# EasyEDA Pro project Board.eprj, board Print A4
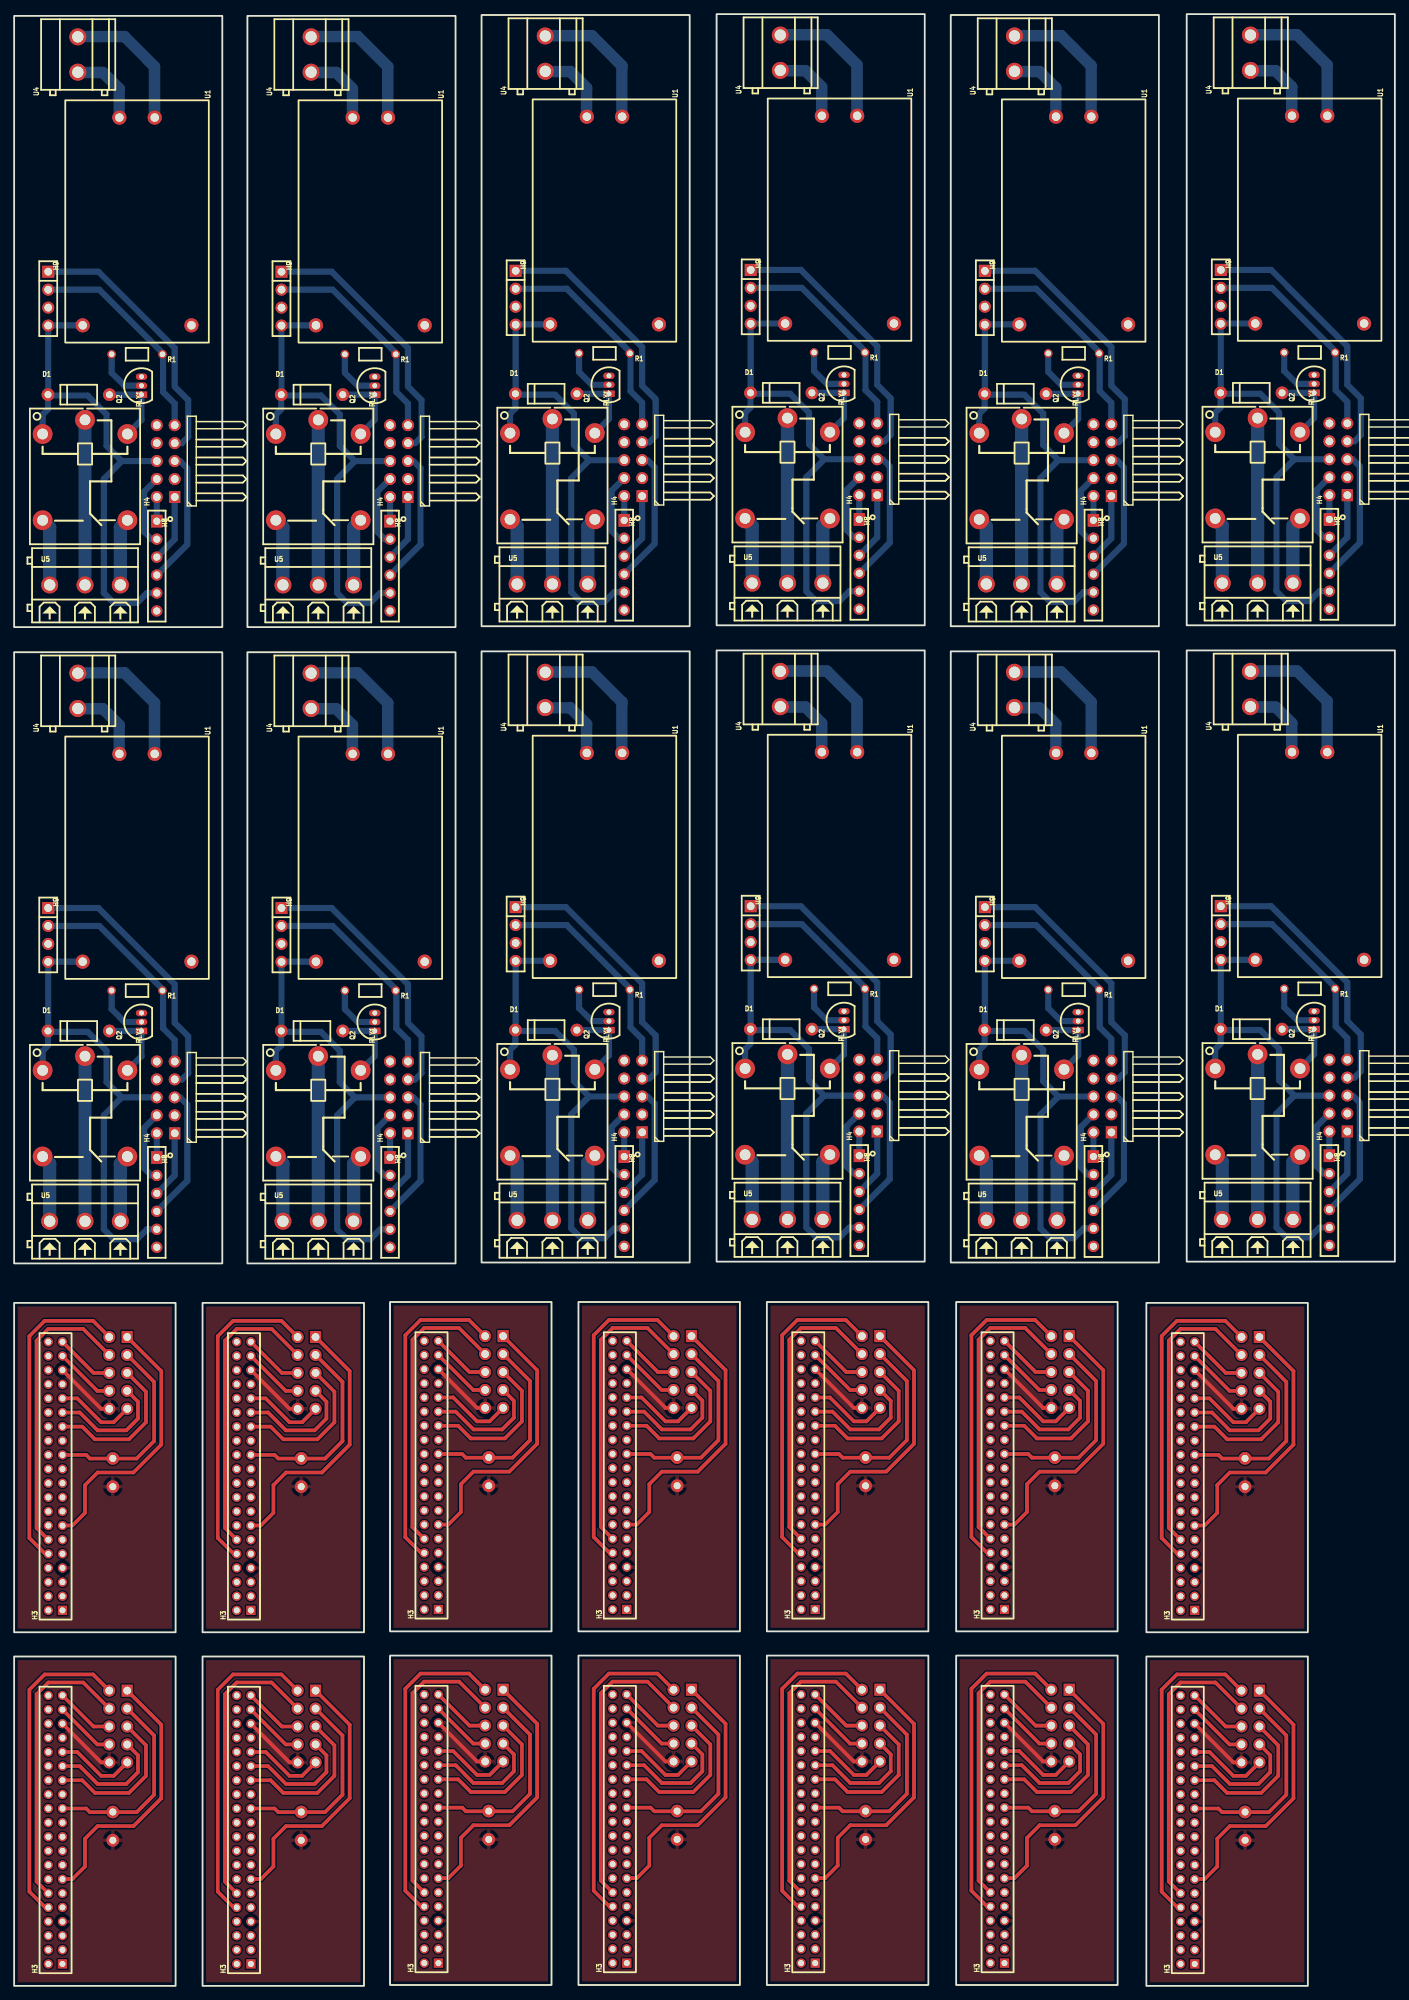
[diagram p4: board, top side]
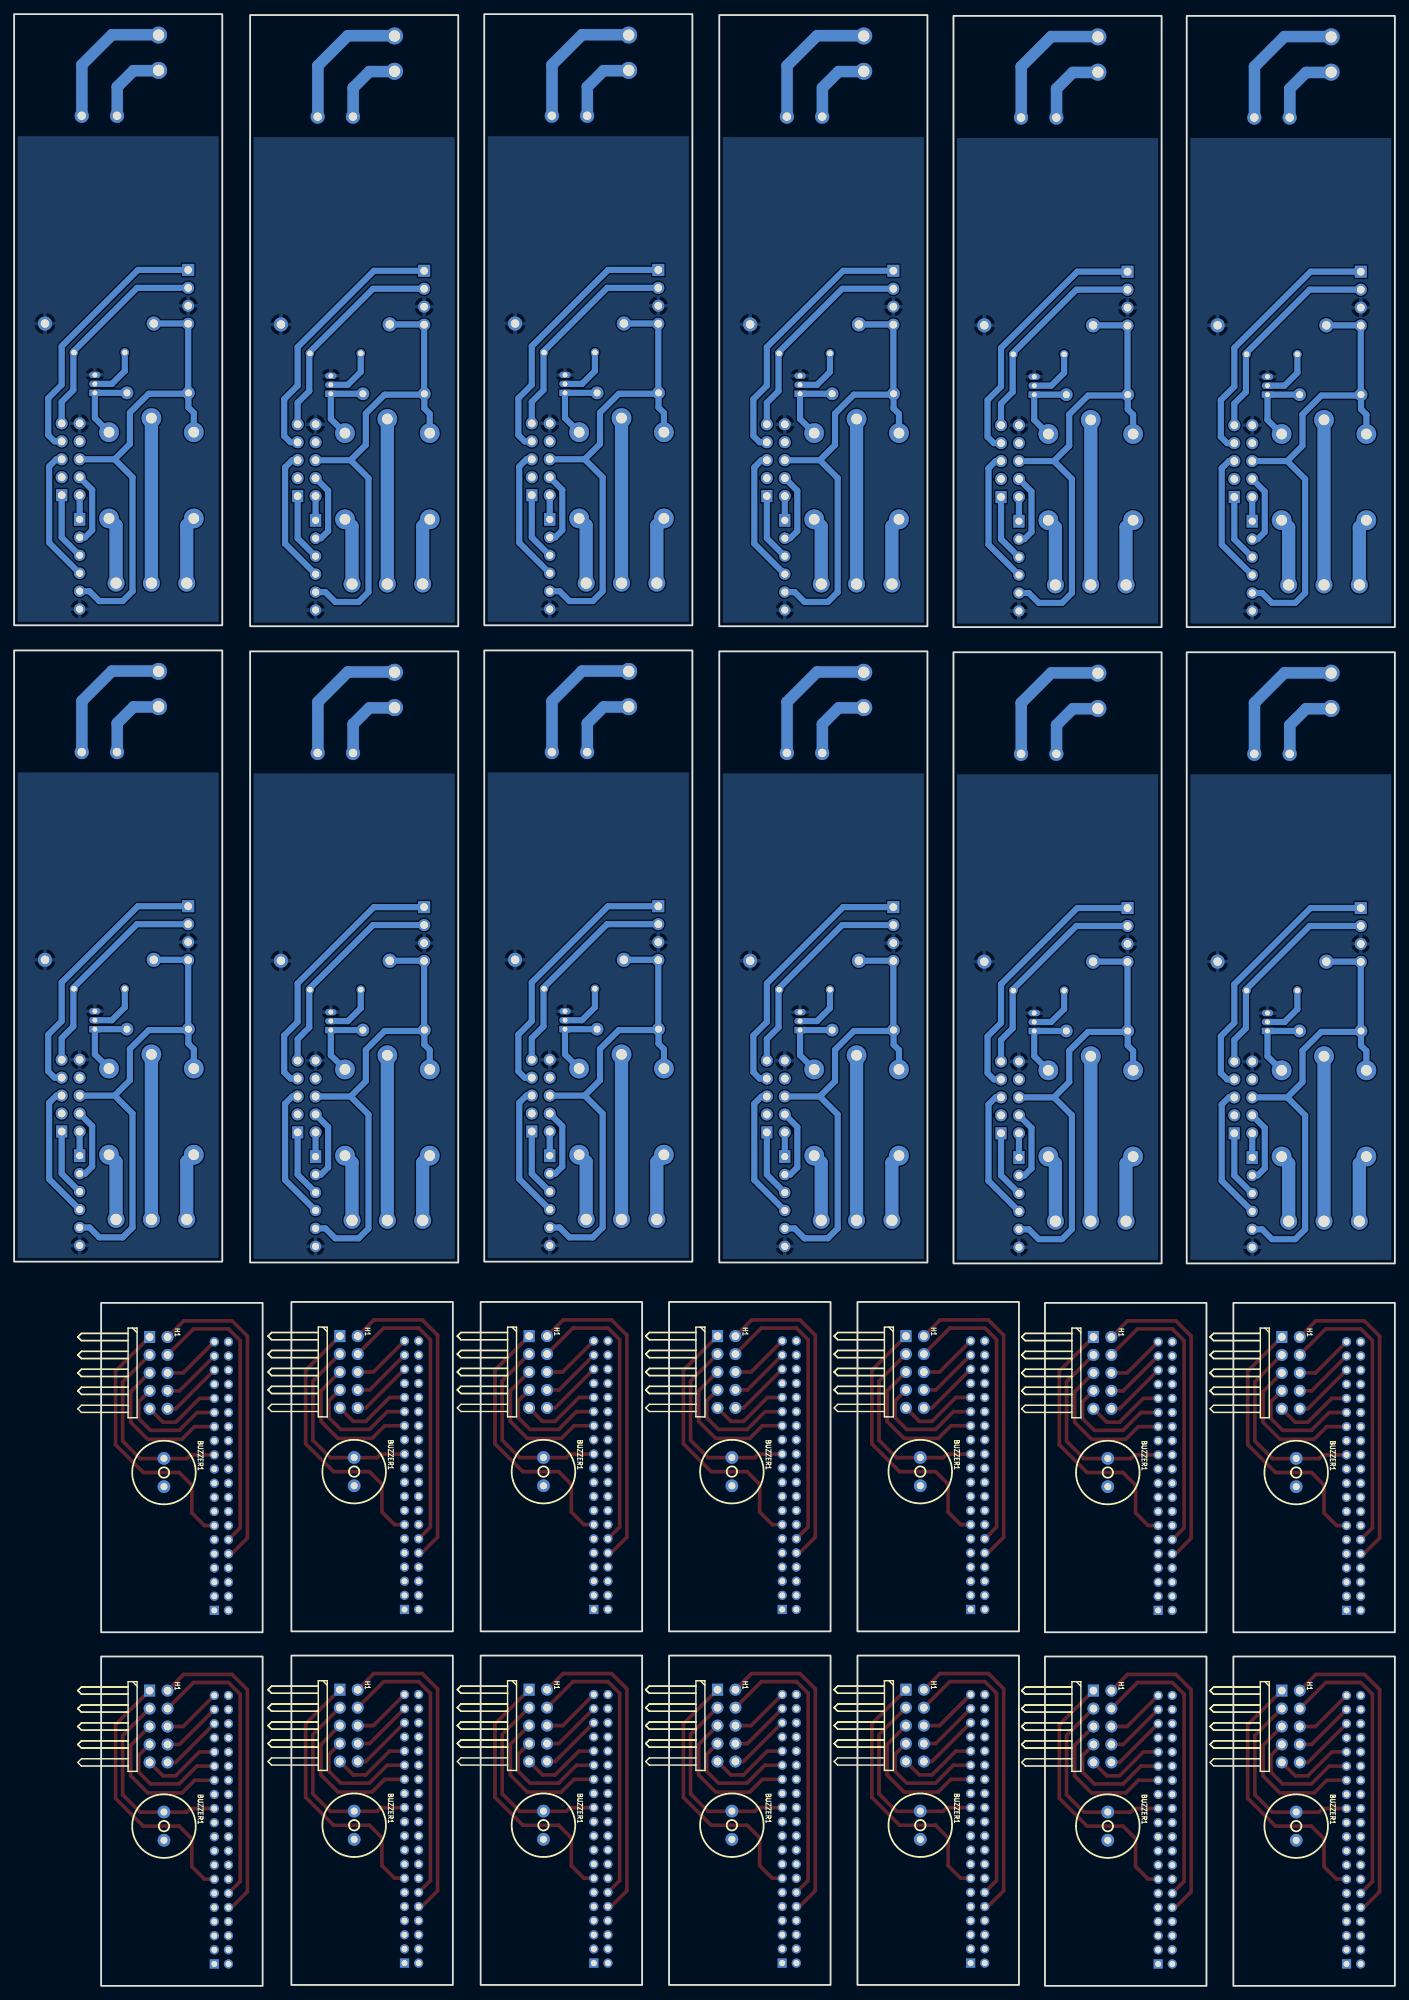
[diagram p5: board, bottom side, seen from below]

Outline 195.45 x 279.02 mm; copper layers: Top Layer, Bottom Layer. Coordinates in mm from the lower left corner of the outline.
Outline path: rectangle 0,50.04 22.86,96.65 ; rectangle 0,0 22.86,46.61 ; rectangle 26.67,50.04 49.53,96.65 ; rectangle 26.67,0 49.53,46.61 ; rectangle 29.46,278.76 0,192.28 ; rectangle 29.46,188.72 0,102.24 ; rectangle 53.21,50.17 76.07,96.77 ; rectangle 53.21,0.13 76.07,46.74 ; rectangle 62.48,278.76 33.02,192.28 ; rectangle 62.48,188.72 33.02,102.24 ; rectangle 79.88,50.17 102.74,96.77 ; rectangle 79.88,0.13 102.74,46.74 ; rectangle 95.63,278.89 66.17,192.41 ; rectangle 95.63,188.85 66.17,102.36 ; rectangle 106.55,50.17 129.41,96.77 ; rectangle 106.55,0.13 129.41,46.74 ; rectangle 128.9,279.02 99.44,192.53 ; rectangle 128.9,188.98 99.44,102.49 ; rectangle 133.35,50.17 156.21,96.77 ; rectangle 133.35,0.13 156.21,46.74 ; rectangle 160.27,50.04 183.13,96.65 ; rectangle 160.27,0 183.13,46.61 ; rectangle 162.05,278.89 132.59,192.41 ; rectangle 162.05,188.85 132.59,102.36 ; rectangle 195.45,279.02 165.99,192.53 ; rectangle 195.45,188.98 165.99,102.49
Stack: Top Layer 0.035mm / Dielectric1 1.51mm FR4 er 4.5 / Bottom Layer 0.035mm

## Design rules (mm)
template: JLCPCB Capability(Two Layers Board)
spacing copperThickness1oz (default): track to track 0.102, other pairs 0.152 to 0.3
spacing copperThickness2oz: track to track 0.203, other pairs 0.152 to 0.3
track width copperThickness1oz (default): min 0.127, default 0.254, max 2.54
track width copperThickness2oz: min 0.203, default 0.254, max 2.54
differential pair differentialPair (default): width min 0.127, default 0.254, max 2.54; gap min 0.152, default 0.152
via viaSize (default): diameter min 0.5, default 0.61, max 10; hole min 0.3, default 0.305, max 6.3

## Placement (name value [footprint] x y rotation side)
BUZZER1  -  [BUZ-TH_BD9.0-P4.00-D0.6-FD]  67.18 72.77 270 bottom
BUZZER1#2  -  [BUZ-TH_BD9.0-P4.00-D0.6-FD]  13.97 22.61 270 bottom
BUZZER1#3  -  [BUZ-TH_BD9.0-P4.00-D0.6-FD]  13.97 72.64 270 bottom
BUZZER1#4  -  [BUZ-TH_BD9.0-P4.00-D0.6-FD]  40.64 72.64 270 bottom
BUZZER1#5  -  [BUZ-TH_BD9.0-P4.00-D0.6-FD]  93.85 72.77 270 bottom
BUZZER1#6  -  [BUZ-TH_BD9.0-P4.00-D0.6-FD]  120.52 72.77 270 bottom
BUZZER1#7  -  [BUZ-TH_BD9.0-P4.00-D0.6-FD]  147.32 72.77 270 bottom
BUZZER1#8  -  [BUZ-TH_BD9.0-P4.00-D0.6-FD]  174.24 72.64 270 bottom
BUZZER1#9  -  [BUZ-TH_BD9.0-P4.00-D0.6-FD]  40.64 22.61 270 bottom
BUZZER1#10  -  [BUZ-TH_BD9.0-P4.00-D0.6-FD]  67.18 22.73 270 bottom
BUZZER1#11  -  [BUZ-TH_BD9.0-P4.00-D0.6-FD]  120.52 22.73 270 bottom
BUZZER1#12  -  [BUZ-TH_BD9.0-P4.00-D0.6-FD]  93.85 22.73 270 bottom
BUZZER1#13  -  [BUZ-TH_BD9.0-P4.00-D0.6-FD]  147.32 22.73 270 bottom
BUZZER1#14  -  [BUZ-TH_BD9.0-P4.00-D0.6-FD]  174.24 22.61 270 bottom
D1  -  [DO-41_BD2.4-L4.7-P8.70-D0.9-RD]  42.16 225.17 0 top
D1#2  -  [DO-41_BD2.4-L4.7-P8.70-D0.9-RD]  75.31 225.3 0 top
D1#3  -  [DO-41_BD2.4-L4.7-P8.70-D0.9-RD]  108.58 225.43 0 top
D1#4  -  [DO-41_BD2.4-L4.7-P8.70-D0.9-RD]  141.73 225.3 0 top
D1#5  -  [DO-41_BD2.4-L4.7-P8.70-D0.9-RD]  175.13 225.43 0 top
D1#6  -  [DO-41_BD2.4-L4.7-P8.70-D0.9-RD]  75.31 135.25 0 top
D1#7  -  [DO-41_BD2.4-L4.7-P8.70-D0.9-RD]  9.14 135.13 0 top
D1#8  -  [DO-41_BD2.4-L4.7-P8.70-D0.9-RD]  42.16 135.13 0 top
D1#9  -  [DO-41_BD2.4-L4.7-P8.70-D0.9-RD]  108.58 135.38 0 top
D1#10  -  [DO-41_BD2.4-L4.7-P8.70-D0.9-RD]  141.73 135.25 0 top
D1#11  -  [DO-41_BD2.4-L4.7-P8.70-D0.9-RD]  175.13 135.38 0 top
D1#12  -  [DO-41_BD2.4-L4.7-P8.70-D0.9-RD]  9.14 225.17 0 top
H1  -  [HDR-TH_10P-P2.54-H-M-R2-C5-S2.54-W12.9]  14.73 86.74 270 bottom
H1#2  -  [HDR-TH_10P-P2.54-H-M-R2-C5-S2.54-W12.9]  41.4 86.74 270 bottom
H1#3  -  [HDR-TH_10P-P2.54-H-M-R2-C5-S2.54-W12.9]  67.95 86.87 270 bottom
H1#4  -  [HDR-TH_10P-P2.54-H-M-R2-C5-S2.54-W12.9]  94.61 86.87 270 bottom
H1#5  -  [HDR-TH_10P-P2.54-H-M-R2-C5-S2.54-W12.9]  121.29 86.87 270 bottom
H1#6  -  [HDR-TH_10P-P2.54-H-M-R2-C5-S2.54-W12.9]  148.08 86.87 270 bottom
H1#7  -  [HDR-TH_10P-P2.54-H-M-R2-C5-S2.54-W12.9]  175.01 86.74 270 bottom
H1#8  -  [HDR-TH_10P-P2.54-H-M-R2-C5-S2.54-W12.9]  14.73 36.7 270 bottom
H1#9  -  [HDR-TH_10P-P2.54-H-M-R2-C5-S2.54-W12.9]  41.4 36.7 270 bottom
H1#10  -  [HDR-TH_10P-P2.54-H-M-R2-C5-S2.54-W12.9]  67.95 36.83 270 bottom
H1#11  -  [HDR-TH_10P-P2.54-H-M-R2-C5-S2.54-W12.9]  94.61 36.83 270 bottom
H1#12  -  [HDR-TH_10P-P2.54-H-M-R2-C5-S2.54-W12.9]  121.29 36.83 270 bottom
H1#13  -  [HDR-TH_10P-P2.54-H-M-R2-C5-S2.54-W12.9]  148.08 36.83 270 bottom
H1#14  -  [HDR-TH_10P-P2.54-H-M-R2-C5-S2.54-W12.9]  175.01 36.7 270 bottom
H3  -  [HDR-TH_40P-P2.00-V-F-R2-C20-S2.00]  5.84 72.14 90 top
H3#2  -  [HDR-TH_40P-P2.00-V-F-R2-C20-S2.00]  32.51 72.14 90 top
H3#3  -  [HDR-TH_40P-P2.00-V-F-R2-C20-S2.00]  59.06 72.26 90 top
H3#4  -  [HDR-TH_40P-P2.00-V-F-R2-C20-S2.00]  85.73 72.26 90 top
H3#5  -  [HDR-TH_40P-P2.00-V-F-R2-C20-S2.00]  112.39 72.26 90 top
H3#6  -  [HDR-TH_40P-P2.00-V-F-R2-C20-S2.00]  139.19 72.26 90 top
H3#7  -  [HDR-TH_40P-P2.00-V-F-R2-C20-S2.00]  166.12 72.14 90 top
H3#8  -  [HDR-TH_40P-P2.00-V-F-R2-C20-S2.00]  5.84 22.1 90 top
H3#9  -  [HDR-TH_40P-P2.00-V-F-R2-C20-S2.00]  32.51 22.1 90 top
H3#10  -  [HDR-TH_40P-P2.00-V-F-R2-C20-S2.00]  59.06 22.23 90 top
H3#11  -  [HDR-TH_40P-P2.00-V-F-R2-C20-S2.00]  85.73 22.23 90 top
H3#12  -  [HDR-TH_40P-P2.00-V-F-R2-C20-S2.00]  112.39 22.23 90 top
H3#13  -  [HDR-TH_40P-P2.00-V-F-R2-C20-S2.00]  139.19 22.23 90 top
H3#14  -  [HDR-TH_40P-P2.00-V-F-R2-C20-S2.00]  166.12 22.1 90 top
H4  -  [HDR-TH_10P-P2.54-H-M-R2-C5-S2.54-W12.9]  54.48 215.77 90 top
H4#2  -  [HDR-TH_10P-P2.54-H-M-R2-C5-S2.54-W12.9]  87.63 215.9 90 top
H4#3  -  [HDR-TH_10P-P2.54-H-M-R2-C5-S2.54-W12.9]  120.9 216.03 90 top
H4#4  -  [HDR-TH_10P-P2.54-H-M-R2-C5-S2.54-W12.9]  154.05 215.9 90 top
H4#5  -  [HDR-TH_10P-P2.54-H-M-R2-C5-S2.54-W12.9]  187.45 216.03 90 top
H4#6  -  [HDR-TH_10P-P2.54-H-M-R2-C5-S2.54-W12.9]  87.63 125.86 90 top
H4#7  -  [HDR-TH_10P-P2.54-H-M-R2-C5-S2.54-W12.9]  21.46 125.73 90 top
H4#8  -  [HDR-TH_10P-P2.54-H-M-R2-C5-S2.54-W12.9]  54.48 125.73 90 top
H4#9  -  [HDR-TH_10P-P2.54-H-M-R2-C5-S2.54-W12.9]  120.9 125.98 90 top
H4#10  -  [HDR-TH_10P-P2.54-H-M-R2-C5-S2.54-W12.9]  154.05 125.86 90 top
H4#11  -  [HDR-TH_10P-P2.54-H-M-R2-C5-S2.54-W12.9]  187.45 125.98 90 top
H4#12  -  [HDR-TH_10P-P2.54-H-M-R2-C5-S2.54-W12.9]  21.46 215.77 90 top
H8  -  [HDR-TH_6P-P2.54-V-F]  53.21 200.91 270 top
H8#2  -  [HDR-TH_6P-P2.54-V-F]  86.36 201.04 270 top
H8#3  -  [HDR-TH_6P-P2.54-V-F]  119.63 201.17 270 top
H8#4  -  [HDR-TH_6P-P2.54-V-F]  152.78 201.04 270 top
H8#5  -  [HDR-TH_6P-P2.54-V-F]  186.18 201.17 270 top
H8#6  -  [HDR-TH_6P-P2.54-V-F]  86.36 111 270 top
H8#7  -  [HDR-TH_6P-P2.54-V-F]  119.63 111.12 270 top
H8#8  -  [HDR-TH_6P-P2.54-V-F]  20.19 110.87 270 top
H8#9  -  [HDR-TH_6P-P2.54-V-F]  53.21 110.87 270 top
H8#10  -  [HDR-TH_6P-P2.54-V-F]  152.78 111 270 top
H8#11  -  [HDR-TH_6P-P2.54-V-F]  186.18 111.12 270 top
H8#12  -  [HDR-TH_6P-P2.54-V-F]  20.19 200.91 270 top
H9  -  [HDR-TH_4P-P2.54-V-F]  37.85 238.76 270 top
H9#2  -  [HDR-TH_4P-P2.54-V-F]  70.99 238.89 270 top
H9#3  -  [HDR-TH_4P-P2.54-V-F]  104.27 239.01 270 top
H9#4  -  [HDR-TH_4P-P2.54-V-F]  137.41 238.89 270 top
H9#5  -  [HDR-TH_4P-P2.54-V-F]  170.81 239.01 270 top
H9#6  -  [HDR-TH_4P-P2.54-V-F]  70.99 148.84 270 top
H9#7  -  [HDR-TH_4P-P2.54-V-F]  37.85 148.72 270 top
H9#8  -  [HDR-TH_4P-P2.54-V-F]  104.27 148.97 270 top
H9#9  -  [HDR-TH_4P-P2.54-V-F]  137.41 148.84 270 top
H9#10  -  [HDR-TH_4P-P2.54-V-F]  170.81 148.97 270 top
H9#11  -  [HDR-TH_4P-P2.54-V-F]  4.83 148.72 270 top
H9#12  -  [HDR-TH_4P-P2.54-V-F]  4.83 238.76 270 top
Q2  -  [TO-92-3_L4.9-W3.7-P1.27-L]  51.05 226.44 90 top
Q2#2  -  [TO-92-3_L4.9-W3.7-P1.27-L]  84.2 226.57 90 top
Q2#3  -  [TO-92-3_L4.9-W3.7-P1.27-L]  117.48 226.7 90 top
Q2#4  -  [TO-92-3_L4.9-W3.7-P1.27-L]  150.62 226.57 90 top
Q2#5  -  [TO-92-3_L4.9-W3.7-P1.27-L]  184.02 226.7 90 top
Q2#6  -  [TO-92-3_L4.9-W3.7-P1.27-L]  84.2 136.53 90 top
Q2#7  -  [TO-92-3_L4.9-W3.7-P1.27-L]  117.48 136.65 90 top
Q2#8  -  [TO-92-3_L4.9-W3.7-P1.27-L]  18.03 136.4 90 top
Q2#9  -  [TO-92-3_L4.9-W3.7-P1.27-L]  51.05 136.4 90 top
Q2#10  -  [TO-92-3_L4.9-W3.7-P1.27-L]  150.62 136.53 90 top
Q2#11  -  [TO-92-3_L4.9-W3.7-P1.27-L]  184.02 136.65 90 top
Q2#12  -  [TO-92-3_L4.9-W3.7-P1.27-L]  18.03 226.44 90 top
R1  -  [RES-TH_BD1.8-L3.2-P7.20-D0.4]  50.42 230.89 180 top
R1#2  -  [RES-TH_BD1.8-L3.2-P7.20-D0.4]  83.57 231.01 180 top
R1#3  -  [RES-TH_BD1.8-L3.2-P7.20-D0.4]  116.84 231.14 180 top
R1#4  -  [RES-TH_BD1.8-L3.2-P7.20-D0.4]  149.99 231.01 180 top
R1#5  -  [RES-TH_BD1.8-L3.2-P7.20-D0.4]  183.39 231.14 180 top
R1#6  -  [RES-TH_BD1.8-L3.2-P7.20-D0.4]  83.57 140.97 180 top
R1#7  -  [RES-TH_BD1.8-L3.2-P7.20-D0.4]  17.4 140.84 180 top
R1#8  -  [RES-TH_BD1.8-L3.2-P7.20-D0.4]  50.42 140.84 180 top
R1#9  -  [RES-TH_BD1.8-L3.2-P7.20-D0.4]  17.4 230.89 180 top
R1#10  -  [RES-TH_BD1.8-L3.2-P7.20-D0.4]  116.84 141.1 180 top
R1#11  -  [RES-TH_BD1.8-L3.2-P7.20-D0.4]  149.99 140.97 180 top
R1#12  -  [RES-TH_BD1.8-L3.2-P7.20-D0.4]  183.39 141.1 180 top
RLY1  -  [RELAY-TH_SRD-XXVDC-XL-C]  43.05 214.5 270 top
RLY1#2  -  [RELAY-TH_SRD-XXVDC-XL-C]  76.2 214.63 270 top
RLY1#3  -  [RELAY-TH_SRD-XXVDC-XL-C]  109.47 214.76 270 top
RLY1#4  -  [RELAY-TH_SRD-XXVDC-XL-C]  142.62 214.63 270 top
RLY1#5  -  [RELAY-TH_SRD-XXVDC-XL-C]  176.02 214.76 270 top
RLY1#6  -  [RELAY-TH_SRD-XXVDC-XL-C]  10.03 124.46 270 top
RLY1#7  -  [RELAY-TH_SRD-XXVDC-XL-C]  43.05 124.46 270 top
RLY1#8  -  [RELAY-TH_SRD-XXVDC-XL-C]  76.2 124.59 270 top
RLY1#9  -  [RELAY-TH_SRD-XXVDC-XL-C]  109.47 124.71 270 top
RLY1#10  -  [RELAY-TH_SRD-XXVDC-XL-C]  142.62 124.59 270 top
RLY1#11  -  [RELAY-TH_SRD-XXVDC-XL-C]  176.02 124.71 270 top
RLY1#12  -  [RELAY-TH_SRD-XXVDC-XL-C]  10.03 214.5 270 top
U1  -  [PWRM-TH_HLK-PM01]  50.42 249.68 270 top
U1#2  -  [PWRM-TH_HLK-PM01]  83.57 249.81 270 top
U1#3  -  [PWRM-TH_HLK-PM01]  116.84 249.94 270 top
U1#4  -  [PWRM-TH_HLK-PM01]  149.99 249.81 270 top
U1#5  -  [PWRM-TH_HLK-PM01]  183.39 249.94 270 top
U1#6  -  [PWRM-TH_HLK-PM01]  83.57 159.77 270 top
U1#7  -  [PWRM-TH_HLK-PM01]  17.4 159.64 270 top
U1#8  -  [PWRM-TH_HLK-PM01]  50.42 159.64 270 top
U1#9  -  [PWRM-TH_HLK-PM01]  116.84 159.89 270 top
U1#10  -  [PWRM-TH_HLK-PM01]  149.99 159.77 270 top
U1#11  -  [PWRM-TH_HLK-PM01]  183.39 159.89 270 top
U1#12  -  [PWRM-TH_HLK-PM01]  17.4 249.68 270 top
U4  -  [CONN-TH_P5.00_KF128-5.0-2P]  42.04 273.3 90 top
U4#2  -  [CONN-TH_P5.00_KF128-5.0-2P]  75.18 273.43 90 top
U4#3  -  [CONN-TH_P5.00_KF128-5.0-2P]  108.46 273.56 90 top
U4#4  -  [CONN-TH_P5.00_KF128-5.0-2P]  141.61 273.43 90 top
U4#5  -  [CONN-TH_P5.00_KF128-5.0-2P]  175.01 273.56 90 top
U4#6  -  [CONN-TH_P5.00_KF128-5.0-2P]  9.02 273.3 90 top
U4#7  -  [CONN-TH_P5.00_KF128-5.0-2P]  75.18 183.39 90 top
U4#8  -  [CONN-TH_P5.00_KF128-5.0-2P]  108.46 183.52 90 top
U4#9  -  [CONN-TH_P5.00_KF128-5.0-2P]  9.02 183.26 90 top
U4#10  -  [CONN-TH_P5.00_KF128-5.0-2P]  42.04 183.26 90 top
U4#11  -  [CONN-TH_P5.00_KF128-5.0-2P]  141.61 183.39 90 top
U4#12  -  [CONN-TH_P5.00_KF128-5.0-2P]  175.01 183.52 90 top
U5  -  [CONN-TH_3P-P5.00_KF128-5.0-3P]  43.05 198.25 0 top
U5#2  -  [CONN-TH_3P-P5.00_KF128-5.0-3P]  76.2 198.37 0 top
U5#3  -  [CONN-TH_3P-P5.00_KF128-5.0-3P]  109.47 198.5 0 top
U5#4  -  [CONN-TH_3P-P5.00_KF128-5.0-3P]  142.62 198.37 0 top
U5#5  -  [CONN-TH_3P-P5.00_KF128-5.0-3P]  176.02 198.5 0 top
U5#6  -  [CONN-TH_3P-P5.00_KF128-5.0-3P]  76.2 108.33 0 top
U5#7  -  [CONN-TH_3P-P5.00_KF128-5.0-3P]  10.03 108.2 0 top
U5#8  -  [CONN-TH_3P-P5.00_KF128-5.0-3P]  109.47 108.46 0 top
U5#9  -  [CONN-TH_3P-P5.00_KF128-5.0-3P]  142.62 108.33 0 top
U5#10  -  [CONN-TH_3P-P5.00_KF128-5.0-3P]  43.05 108.2 0 top
U5#11  -  [CONN-TH_3P-P5.00_KF128-5.0-3P]  176.02 108.46 0 top
U5#12  -  [CONN-TH_3P-P5.00_KF128-5.0-3P]  10.03 198.25 0 top

## Footprints (pads in the part's own frame, mm; a bottom-side part is the same pattern mirrored in y, then rotated)
BUZ-TH_BD9.0-P4.00-D0.6-FD
  round 1.8 hole 1: 1(-2,0) 2(2,0)
CONN-TH_3P-P5.00_KF128-5.0-3P
  round 2.4 hole 1.6: 1(-5,0) 2(0,0) 3(5,0)
CONN-TH_P5.00_KF128-5.0-2P
  round 2.4 hole 1.6: 1(-2.5,0) 2(2.5,0)
DO-41_BD2.4-L4.7-P8.70-D0.9-RD
  round 1.8 hole 1: 1(-4.35,0) 2(4.35,0)
HDR-TH_4P-P2.54-V-F
  rect 1.7x1.7 hole 1.1: 1(-3.81,0)
  round 1.7 hole 1.1: 2(-1.27,0) 3(1.27,0) 4(3.81,0)
HDR-TH_6P-P2.54-V-F
  rect 1.8x1.6 hole 1.02: 1(-6.35,0)
  round 1.6 hole 1.02: 2(-3.81,0) 3(-1.27,0) 4(1.27,0) 5(3.81,0) 6(6.35,0)
HDR-TH_10P-P2.54-H-M-R2-C5-S2.54-W12.9
  rect 1.7x1.575 hole 1.1: 1(-5.08,-1.27)
  round 1.7 hole 1.1: 2(-5.08,1.27) 3(-2.54,-1.27) 4(-2.54,1.27) 5(0,-1.27) 6(0,1.27) 7(2.54,-1.27) 8(2.54,1.27) 9(5.08,-1.27) 10(5.08,1.27)
HDR-TH_40P-P2.00-V-F-R2-C20-S2.00
  rect 1.3x1.3 hole 0.85: 1(-19,-1)
  round 1.3 hole 0.85: 2(-19,1) 3(-17,-1) 4(-17,1) 5(-15,-1) 6(-15,1) 7(-13,-1) 8(-13,1) 9(-11,-1) 10(-11,1) 11(-9,-1) 12(-9,1) 13(-7,-1) 14(-7,1) 15(-5,-1) 16(-5,1) 17(-3,-1) 18(-3,1) 19(-1,-1) 20(-1,1) 21(1,-1) 22(1,1) 23(3,-1) 24(3,1) 25(5,-1) 26(5,1) 27(7,-1) 28(7,1) 29(9,-1) 30(9,1) 31(11,-1) 32(11,1) 33(13,-1) 34(13,1) 35(15,-1) 36(15,1) 37(17,-1) 38(17,1) 39(19,-1) 40(19,1)
PWRM-TH_HLK-PM01
  round 2 hole 1.2: 1(-14.7,2.5) 2(-14.7,-2.5) 3(14.7,7.7) 4(14.7,-7.7)
RELAY-TH_SRD-XXVDC-XL-C
  round 2.794 hole 1.524: 1(-5.1,-6) 2(7.1,-6) 3(7.1,6) 4(-5.1,6) 5(-7.1,0)
RES-TH_BD1.8-L3.2-P7.20-D0.4
  round 1.2 hole 0.8: 1(-3.6,0) 2(3.6,0)
TO-92-3_L4.9-W3.7-P1.27-L
  rect 0.9x1.6 hole 0.7: 1(-1.27,0)
  oval 0.9x1.6 hole 0.7: 2(0,0) 3(1.27,0)

## Nets
3.3V: H1.8 H1#2.8 H1#3.8 H1#4.8 H1#5.8 H1#6.8 H1#7.8 H1#8.8 H1#9.8 H1#10.8 H1#11.8 H1#12.8 H1#13.8 H1#14.8 H3.37 H3#2.37 H3#3.37 H3#4.37 H3#5.37 H3#6.37 H3#7.37 H3#8.37 H3#9.37 H3#10.37 H3#11.37 H3#12.37 H3#13.37 H3#14.37 H4.8 H4#2.8 H4#3.8 H4#4.8 H4#5.8 H4#6.8 H4#7.8 H4#8.8 H4#9.8 H4#10.8 H4#11.8 H4#12.8
5V: D1.1 D1#2.1 D1#3.1 D1#4.1 D1#5.1 D1#6.1 D1#7.1 D1#8.1 D1#9.1 D1#10.1 D1#11.1 D1#12.1 H1.6 H1#2.6 H1#3.6 H1#4.6 H1#5.6 H1#6.6 H1#7.6 H1#8.6 H1#9.6 H1#10.6 H1#11.6 H1#12.6 H1#13.6 H1#14.6 H3.39 H3#2.39 H3#3.39 H3#4.39 H3#5.39 H3#6.39 H3#7.39 H3#8.39 H3#9.39 H3#10.39 H3#11.39 H3#12.39 H3#13.39 H3#14.39 H4.6 H4#2.6 H4#3.6 H4#4.6 H4#5.6 H4#6.6 H4#7.6 H4#8.6 H4#9.6 H4#10.6 H4#11.6 H4#12.6 H8.5 H8#2.5 H8#3.5 H8#4.5 H8#5.5 H8#6.5 H8#7.5 H8#8.5 H8#9.5 H8#10.5 H8#11.5 H8#12.5 H9.4 H9#2.4 H9#3.4 H9#4.4 H9#5.4 H9#6.4 H9#7.4 H9#8.4 H9#9.4 H9#10.4 H9#11.4 H9#12.4 RLY1.1 RLY1#2.1 RLY1#3.1 RLY1#4.1 RLY1#5.1 RLY1#6.1 RLY1#7.1 RLY1#8.1 RLY1#9.1 RLY1#10.1 RLY1#11.1 RLY1#12.1 U1.4 U1#2.4 U1#3.4 U1#4.4 U1#5.4 U1#6.4 U1#7.4 U1#8.4 U1#9.4 U1#10.4 U1#11.4 U1#12.4
GND: BUZZER1.2 BUZZER1#2.2 BUZZER1#3.2 BUZZER1#4.2 BUZZER1#5.2 BUZZER1#6.2 BUZZER1#7.2 BUZZER1#8.2 BUZZER1#9.2 BUZZER1#10.2 BUZZER1#11.2 BUZZER1#12.2 BUZZER1#13.2 BUZZER1#14.2 H1.10 H1#2.10 H1#3.10 H1#4.10 H1#5.10 H1#6.10 H1#7.10 H1#8.10 H1#9.10 H1#10.10 H1#11.10 H1#12.10 H1#13.10 H1#14.10 H3.7 H3.35 H3#2.7 H3#2.35 H3#3.7 H3#3.35 H3#4.7 H3#4.35 H3#5.7 H3#5.35 H3#6.7 H3#6.35 H3#7.7 H3#7.35 H3#8.7 H3#8.35 H3#9.7 H3#9.35 H3#10.7 H3#10.35 H3#11.7 H3#11.35 H3#12.7 H3#12.35 H3#13.7 H3#13.35 H3#14.7 H3#14.35 H4.10 H4#2.10 H4#3.10 H4#4.10 H4#5.10 H4#6.10 H4#7.10 H4#8.10 H4#9.10 H4#10.10 H4#11.10 H4#12.10 H8.6 H8#2.6 H8#3.6 H8#4.6 H8#5.6 H8#6.6 H8#7.6 H8#8.6 H8#9.6 H8#10.6 H8#11.6 H8#12.6 H9.3 H9#2.3 H9#3.3 H9#4.3 H9#5.3 H9#6.3 H9#7.3 H9#8.3 H9#9.3 H9#10.3 H9#11.3 H9#12.3 Q2.3 Q2#2.3 Q2#3.3 Q2#4.3 Q2#5.3 Q2#6.3 Q2#7.3 Q2#8.3 Q2#9.3 Q2#10.3 Q2#11.3 Q2#12.3 U1.3 U1#2.3 U1#3.3 U1#4.3 U1#5.3 U1#6.3 U1#7.3 U1#8.3 U1#9.3 U1#10.3 U1#11.3 U1#12.3
BUZZ: BUZZER1.1 BUZZER1#2.1 BUZZER1#3.1 BUZZER1#4.1 BUZZER1#5.1 BUZZER1#6.1 BUZZER1#7.1 BUZZER1#8.1 BUZZER1#9.1 BUZZER1#10.1 BUZZER1#11.1 BUZZER1#12.1 BUZZER1#13.1 BUZZER1#14.1 H1.3 H1#2.3 H1#3.3 H1#4.3 H1#5.3 H1#6.3 H1#7.3 H1#8.3 H1#9.3 H1#10.3 H1#11.3 H1#12.3 H1#13.3 H1#14.3 H3.23 H3#2.23 H3#3.23 H3#4.23 H3#5.23 H3#6.23 H3#7.23 H3#8.23 H3#9.23 H3#10.23 H3#11.23 H3#12.23 H3#13.23 H3#14.23
CD2: H1.7 H1#2.7 H1#3.7 H1#4.7 H1#5.7 H1#6.7 H1#7.7 H1#8.7 H1#9.7 H1#10.7 H1#11.7 H1#12.7 H1#13.7 H1#14.7 H3.29 H3#2.29 H3#3.29 H3#4.29 H3#5.29 H3#6.29 H3#7.29 H3#8.29 H3#9.29 H3#10.29 H3#11.29 H3#12.29 H3#13.29 H3#14.29
IO32: H4.7 H4#2.7 H4#3.7 H4#4.7 H4#5.7 H4#6.7 H4#7.7 H4#8.7 H4#9.7 H4#10.7 H4#11.7 H4#12.7 H9.1 H9#2.1 H9#3.1 H9#4.1 H9#5.1 H9#6.1 H9#7.1 H9#8.1 H9#9.1 H9#10.1 H9#11.1 H9#12.1
IO33: H1.9 H1#2.9 H1#3.9 H1#4.9 H1#5.9 H1#6.9 H1#7.9 H1#8.9 H1#9.9 H1#10.9 H1#11.9 H1#12.9 H1#13.9 H1#14.9 H3.31 H3#2.31 H3#3.31 H3#4.31 H3#5.31 H3#6.31 H3#7.31 H3#8.31 H3#9.31 H3#10.31 H3#11.31 H3#12.31 H3#13.31 H3#14.31 H4.9 H4#2.9 H4#3.9 H4#4.9 H4#5.9 H4#6.9 H4#7.9 H4#8.9 H4#9.9 H4#10.9 H4#11.9 H4#12.9 H9.2 H9#2.2 H9#3.2 H9#4.2 H9#5.2 H9#6.2 H9#7.2 H9#8.2 H9#9.2 H9#10.2 H9#11.2 H9#12.2 R1.1 R1#2.1 R1#3.1 R1#4.1 R1#5.1 R1#6.1 R1#7.1 R1#8.1 R1#9.1 R1#10.1 R1#11.1 R1#12.1
RX: H1.1 H1#2.1 H1#3.1 H1#4.1 H1#5.1 H1#6.1 H1#7.1 H1#8.1 H1#9.1 H1#10.1 H1#11.1 H1#12.1 H1#13.1 H1#14.1 H3.13 H3#2.13 H3#3.13 H3#4.13 H3#5.13 H3#6.13 H3#7.13 H3#8.13 H3#9.13 H3#10.13 H3#11.13 H3#12.13 H3#13.13 H3#14.13 H4.1 H4#2.1 H4#3.1 H4#4.1 H4#5.1 H4#6.1 H4#7.1 H4#8.1 H4#9.1 H4#10.1 H4#11.1 H4#12.1 H8.3 H8#2.3 H8#3.3 H8#4.3 H8#5.3 H8#6.3 H8#7.3 H8#8.3 H8#9.3 H8#10.3 H8#11.3 H8#12.3
SCL: H1.4 H1#2.4 H1#3.4 H1#4.4 H1#5.4 H1#6.4 H1#7.4 H1#8.4 H1#9.4 H1#10.4 H1#11.4 H1#12.4 H1#13.4 H1#14.4 H3.12 H3#2.12 H3#3.12 H3#4.12 H3#5.12 H3#6.12 H3#7.12 H3#8.12 H3#9.12 H3#10.12 H3#11.12 H3#12.12 H3#13.12 H3#14.12 H4.4 H4#2.4 H4#3.4 H4#4.4 H4#5.4 H4#6.4 H4#7.4 H4#8.4 H4#9.4 H4#10.4 H4#11.4 H4#12.4 H8.2 H8#2.2 H8#3.2 H8#4.2 H8#5.2 H8#6.2 H8#7.2 H8#8.2 H8#9.2 H8#10.2 H8#11.2 H8#12.2
SDA: H1.2 H1#2.2 H1#3.2 H1#4.2 H1#5.2 H1#6.2 H1#7.2 H1#8.2 H1#9.2 H1#10.2 H1#11.2 H1#12.2 H1#13.2 H1#14.2 H3.10 H3#2.10 H3#3.10 H3#4.10 H3#5.10 H3#6.10 H3#7.10 H3#8.10 H3#9.10 H3#10.10 H3#11.10 H3#12.10 H3#13.10 H3#14.10 H4.2 H4#2.2 H4#3.2 H4#4.2 H4#5.2 H4#6.2 H4#7.2 H4#8.2 H4#9.2 H4#10.2 H4#11.2 H4#12.2 H8.1 H8#2.1 H8#3.1 H8#4.1 H8#5.1 H8#6.1 H8#7.1 H8#8.1 H8#9.1 H8#10.1 H8#11.1 H8#12.1
TX: H1.5 H1#2.5 H1#3.5 H1#4.5 H1#5.5 H1#6.5 H1#7.5 H1#8.5 H1#9.5 H1#10.5 H1#11.5 H1#12.5 H1#13.5 H1#14.5 H3.27 H3#2.27 H3#3.27 H3#4.27 H3#5.27 H3#6.27 H3#7.27 H3#8.27 H3#9.27 H3#10.27 H3#11.27 H3#12.27 H3#13.27 H3#14.27 H4.5 H4#2.5 H4#3.5 H4#4.5 H4#5.5 H4#6.5 H4#7.5 H4#8.5 H4#9.5 H4#10.5 H4#11.5 H4#12.5 H8.4 H8#2.4 H8#3.4 H8#4.4 H8#5.4 H8#6.4 H8#7.4 H8#8.4 H8#9.4 H8#10.4 H8#11.4 H8#12.4
$1N407: RLY1.3 RLY1#2.3 RLY1#3.3 RLY1#4.3 RLY1#5.3 RLY1#6.3 RLY1#7.3 RLY1#8.3 RLY1#9.3 RLY1#10.3 RLY1#11.3 RLY1#12.3 U5.3 U5#2.3 U5#3.3 U5#4.3 U5#5.3 U5#6.3 U5#7.3 U5#8.3 U5#9.3 U5#10.3 U5#11.3 U5#12.3
$1N669: Q2.2 Q2#2.2 Q2#3.2 Q2#4.2 Q2#5.2 Q2#6.2 Q2#7.2 Q2#8.2 Q2#9.2 Q2#10.2 Q2#11.2 Q2#12.2 R1.2 R1#2.2 R1#3.2 R1#4.2 R1#5.2 R1#6.2 R1#7.2 R1#8.2 R1#9.2 R1#10.2 R1#11.2 R1#12.2
$1N719: U1.1 U1#2.1 U1#3.1 U1#4.1 U1#5.1 U1#6.1 U1#7.1 U1#8.1 U1#9.1 U1#10.1 U1#11.1 U1#12.1 U4.2 U4#2.2 U4#3.2 U4#4.2 U4#5.2 U4#6.2 U4#7.2 U4#8.2 U4#9.2 U4#10.2 U4#11.2 U4#12.2
$1N726: U1.2 U1#2.2 U1#3.2 U1#4.2 U1#5.2 U1#6.2 U1#7.2 U1#8.2 U1#9.2 U1#10.2 U1#11.2 U1#12.2 U4.1 U4#2.1 U4#3.1 U4#4.1 U4#5.1 U4#6.1 U4#7.1 U4#8.1 U4#9.1 U4#10.1 U4#11.1 U4#12.1
$1N778: RLY1.5 RLY1#2.5 RLY1#3.5 RLY1#4.5 RLY1#5.5 RLY1#6.5 RLY1#7.5 RLY1#8.5 RLY1#9.5 RLY1#10.5 RLY1#11.5 RLY1#12.5 U5.2 U5#2.2 U5#3.2 U5#4.2 U5#5.2 U5#6.2 U5#7.2 U5#8.2 U5#9.2 U5#10.2 U5#11.2 U5#12.2
$1N787: RLY1.2 RLY1#2.2 RLY1#3.2 RLY1#4.2 RLY1#5.2 RLY1#6.2 RLY1#7.2 RLY1#8.2 RLY1#9.2 RLY1#10.2 RLY1#11.2 RLY1#12.2 U5.1 U5#2.1 U5#3.1 U5#4.1 U5#5.1 U5#6.1 U5#7.1 U5#8.1 U5#9.1 U5#10.1 U5#11.1 U5#12.1
$1N2276: D1.2 D1#2.2 D1#3.2 D1#4.2 D1#5.2 D1#6.2 D1#7.2 D1#8.2 D1#9.2 D1#10.2 D1#11.2 D1#12.2 Q2.1 Q2#2.1 Q2#3.1 Q2#4.1 Q2#5.1 Q2#6.1 Q2#7.1 Q2#8.1 Q2#9.1 Q2#10.1 Q2#11.1 Q2#12.1 RLY1.4 RLY1#2.4 RLY1#3.4 RLY1#4.4 RLY1#5.4 RLY1#6.4 RLY1#7.4 RLY1#8.4 RLY1#9.4 RLY1#10.4 RLY1#11.4 RLY1#12.4

Pads without a net: H3 1 2 3 4 5 6 8 9 11 14 15 16 17 18 19 20 21 22 24 25 26 28 30 32 33 34 36 38 40; H3#2 1 2 3 4 5 6 8 9 11 14 15 16 17 18 19 20 21 22 24 25 26 28 30 32 33 34 36 38 40; H3#3 1 2 3 4 5 6 8 9 11 14 15 16 17 18 19 20 21 22 24 25 26 28 30 32 33 34 36 38 40; H3#4 1 2 3 4 5 6 8 9 11 14 15 16 17 18 19 20 21 22 24 25 26 28 30 32 33 34 36 38 40; H3#5 1 2 3 4 5 6 8 9 11 14 15 16 17 18 19 20 21 22 24 25 26 28 30 32 33 34 36 38 40; H3#6 1 2 3 4 5 6 8 9 11 14 15 16 17 18 19 20 21 22 24 25 26 28 30 32 33 34 36 38 40; H3#7 1 2 3 4 5 6 8 9 11 14 15 16 17 18 19 20 21 22 24 25 26 28 30 32 33 34 36 38 40; H3#8 1 2 3 4 5 6 8 9 11 14 15 16 17 18 19 20 21 22 24 25 26 28 30 32 33 34 36 38 40; H3#9 1 2 3 4 5 6 8 9 11 14 15 16 17 18 19 20 21 22 24 25 26 28 30 32 33 34 36 38 40; H3#10 1 2 3 4 5 6 8 9 11 14 15 16 17 18 19 20 21 22 24 25 26 28 30 32 33 34 36 38 40; H3#11 1 2 3 4 5 6 8 9 11 14 15 16 17 18 19 20 21 22 24 25 26 28 30 32 33 34 36 38 40; H3#12 1 2 3 4 5 6 8 9 11 14 15 16 17 18 19 20 21 22 24 25 26 28 30 32 33 34 36 38 40; H3#13 1 2 3 4 5 6 8 9 11 14 15 16 17 18 19 20 21 22 24 25 26 28 30 32 33 34 36 38 40; H3#14 1 2 3 4 5 6 8 9 11 14 15 16 17 18 19 20 21 22 24 25 26 28 30 32 33 34 36 38 40; H4 3; H4#2 3; H4#3 3; H4#4 3; H4#5 3; H4#6 3; H4#7 3; H4#8 3; H4#9 3; H4#10 3; H4#11 3; H4#12 3

## Routing (per net, layer and track width the routed paths; a pad name or vN(x,y) marks a point on that pad's centre or on a via; arc(x,y) is an arc through that point)
3.3V: length 121.3
  Top Layer w0.52: H1#14.8 172.05,34.16 H3#14.37 ; H1#12.8 118.33,34.29 H3#12.37 ; H1.8 11.78,84.2 H3.37 ; H1#8.8 11.78,34.16 H3#8.37 ; H3#11.37 91.66,34.29 H1#11.8 ; H3#2.37 38.45,84.2 H1#2.8 ; H1#9.8 38.45,34.16 H3#9.37 ; H1#10.8 64.99,34.29 H3#10.37 ; H1#4.8 91.66,84.33 H3#4.37 ; H3#6.37 145.13,84.33 H1#6.8 ; H1#7.8 172.05,84.2 H3#7.37 ; H1#3.8 64.99,84.33 H3#3.37 ; H1#5.8 118.33,84.33 H3#5.37 ; H1#13.8 145.13,34.29 H3#13.37
5V: length 965.1
  Top Layer w0.52: H3#10.39 64.45,36.83 H1#10.6 ; H3#9.39 37.91,36.7 H1#9.6 ; H3#14.39 171.51,36.7 H1#14.6 ; H3#11.39 91.12,36.83 H1#11.6 ; H3#5.39 117.79,86.87 H1#5.6 ; H1#8.6 11.24,36.7 H3#8.39 ; H1#12.6 117.79,36.83 H3#12.39 ; H1#3.6 64.45,86.87 H3#3.39 ; H3.39 11.24,86.74 H1.6 ; H3#13.39 144.59,36.83 H1#13.6 ; H1#4.6 91.12,86.87 H3#4.39 ; H1#7.6 171.51,86.74 H3#7.39 ; H1#6.6 144.59,86.87 H3#6.39 ; H3#2.39 37.91,86.74 H1#2.6
  Bottom Layer w0.87: D1#9.1 104.23,133.32 103.47,132.56 RLY1#9.1 ; D1#9.1 104.27,135.41 H9#8.4 ; D1#9.1 104.36,135.25 109.86,135.25 112.52,132.59 112.52,128.14 114.68,125.98 ; H9#12.4 4.83,225.2 D1#12.1 ; 147.83,215.9 145.67,218.06 145.67,222.5 143,225.17 137.51,225.17 137.38,225.3 ; 147.83,215.9 H4#4.6 ; 147.83,215.9 145.29,213.36 145.29,197.23 146.69,195.83 149.99,195.83 151.38,197.23 H8#4.5 ; H4#5.6 181.23,216.03 ; 181.23,216.03 179.07,218.19 179.07,222.63 176.4,225.3 170.91,225.3 D1#5.1 ; 181.23,216.03 178.69,213.49 178.69,197.36 180.09,195.96 183.39,195.96 184.79,197.36 H8#5.5 ; D1#11.1 170.81,135.41 H9#10.4 ; D1#11.1 170.91,135.25 176.4,135.25 179.07,132.59 179.07,128.14 181.23,125.98 ; D1#11.1 170.78,133.32 170.02,132.56 RLY1#11.1 ; H8#11.5 184.79,107.31 183.39,105.92 180.09,105.92 178.69,107.31 178.69,123.44 181.23,125.98 ; H4#9.6 114.68,125.98 ; 114.68,125.98 112.14,123.44 112.14,107.31 113.54,105.92 116.84,105.92 118.24,107.31 H8#7.5 ; 37.05,219.6 37.05,222.35 37.81,223.11 D1.1 ; 137.38,225.3 137.38,223.23 136.62,222.47 RLY1#4.1 ; 137.38,225.3 137.41,225.33 H9#4.4 ; 181.23,125.98 H4#11.6 ; D1#2.1 70.96,223.23 70.2,222.47 RLY1#2.1 ; D1#2.1 70.99,225.33 H9#2.4 ; D1#2.1 71.09,225.17 76.58,225.17 79.25,222.5 79.25,218.06 81.41,215.9 ; 5.08,234.95 5.11,234.98 U1#12.4 ; 104.52,145.16 104.55,145.19 U1#9.4 ; D1#5.1 170.81,225.46 H9#5.4 ; D1#5.1 170.78,223.36 170.02,222.6 170.02,219.86 ; D1#7.1 4.83,135.16 H9#11.4 ; D1#7.1 4.79,133.06 4.03,132.3 RLY1#6.1 ; D1#7.1 4.92,135 10.41,135 13.08,132.33 13.08,127.89 15.24,125.73 ; H9#6.4 70.99,135.29 D1#6.1 ; 137.38,135.25 137.41,135.29 H9#9.4 ; 137.38,135.25 137.38,133.19 136.62,132.43 RLY1#10.1 ; 137.38,135.25 137.51,135.13 143,135.13 145.67,132.46 145.67,128.02 147.83,125.86 ; D1#6.1 70.96,133.19 70.2,132.43 RLY1#8.1 ; D1#6.1 71.09,135.13 76.58,135.13 79.25,132.46 79.25,128.02 81.41,125.86 ; H4#2.6 81.41,215.9 ; 81.41,215.9 78.87,213.36 78.87,197.23 80.26,195.83 83.57,195.83 84.96,197.23 H8#2.5 ; D1#3.1 104.27,225.46 H9#3.4 ; D1#3.1 104.23,223.36 103.47,222.6 103.47,219.86 ; D1#3.1 104.36,225.3 109.86,225.3 112.52,222.63 112.52,218.19 114.68,216.03 ; 38.1,234.95 38.13,234.98 U1.4 ; 104.52,235.2 104.55,235.24 U1#3.4 ; D1#8.1 37.85,135.16 H9#7.4 ; D1#8.1 37.81,133.06 37.05,132.3 RLY1#7.1 ; D1#8.1 37.94,135 43.43,135 46.1,132.33 46.1,127.89 48.26,125.73 ; 171.07,145.16 171.1,145.19 U1#11.4 ; 38.1,144.91 38.13,144.94 U1#8.4 ; H4#12.6 15.24,215.77 ; 15.24,215.77 13.08,217.93 13.08,222.38 10.41,225.04 4.92,225.04 D1#12.1 ; 15.24,215.77 12.7,213.23 12.7,197.1 14.1,195.71 17.4,195.71 18.8,197.1 H8#12.5 ; H8.5 51.82,197.1 50.42,195.71 47.12,195.71 45.72,197.1 45.72,213.23 48.26,215.77 ; U1#7.4 5.11,144.94 5.08,144.91 ; D1#12.1 4.79,223.11 4.03,222.35 4.03,219.6 ; 48.26,215.77 46.1,217.93 46.1,222.38 43.43,225.04 37.94,225.04 D1.1 ; 48.26,215.77 H4.6 ; H8#3.5 118.24,197.36 116.84,195.96 113.54,195.96 112.14,197.36 112.14,213.49 114.68,216.03 ; U1#5.4 171.1,235.24 171.07,235.2 ; D1.1 37.85,225.2 H9.4 ; U1#6.4 71.28,145.07 71.25,145.03 ; U1#2.4 71.28,235.11 71.25,235.08 ; 147.83,125.86 145.29,123.32 145.29,107.19 146.69,105.79 149.99,105.79 151.38,107.19 H8#10.5 ; 147.83,125.86 H4#10.6 ; 137.67,145.03 137.7,145.07 U1#10.4 ; 114.68,216.03 H4#3.6 ; 15.24,125.73 12.7,123.19 12.7,107.06 14.1,105.66 17.4,105.66 18.8,107.06 H8#8.5 ; 15.24,125.73 H4#7.6 ; H4#8.6 48.26,125.73 ; 48.26,125.73 45.72,123.19 45.72,107.06 47.12,105.66 50.42,105.66 51.82,107.06 H8#9.5 ; 81.41,125.86 78.87,123.32 78.87,107.19 80.26,105.79 83.57,105.79 84.96,107.19 H8#6.5 ; 81.41,125.86 H4#6.6 ; 137.67,235.08 137.7,235.11 U1#4.4
GND: length 124.4
  Top Layer w0.52: H3#9.35 38.99,31.62 40.13,31.62 ; H1#10.10 65.53,31.75 H3#10.35 ; H1#2.10 38.99,81.66 H3#2.35 ; H1#7.10 172.59,81.66 H3#7.35 ; H1#4.10 92.2,81.79 H3#4.35 ; H3#11.35 92.2,31.75 H1#11.10 ; H1.10 12.32,81.66 H3.35 ; H1#13.10 145.67,31.75 H3#13.35 ; H1#12.10 118.87,31.75 H3#12.35 ; H3#14.35 172.59,31.62 173.74,31.62 ; H1#3.10 65.53,81.79 H3#3.35 ; H3#6.35 145.67,81.79 H1#6.10 ; 13.46,31.62 12.32,31.62 H3#8.35 ; H1#5.10 118.87,81.79 H3#5.35
BUZZ: length 391.7
  Top Layer w0.52: 176.28,39.24 180.09,35.43 180.09,27.05 177.61,24.58 171,24.58 170.48,25.1 H3#14.23 ; H3#2.23 36.88,75.14 37.4,74.62 44.01,74.62 46.48,77.09 46.48,85.47 H1#2.3 ; H1#10.3 73.03,35.56 73.03,27.18 70.55,24.71 63.94,24.71 63.42,25.23 H3#10.23 ; H3#13.23 143.56,25.23 144.08,24.71 150.69,24.71 153.16,27.18 153.16,35.56 H1#13.3 ; H1#12.3 126.36,35.56 126.36,27.18 123.89,24.71 117.28,24.71 116.76,25.23 H3#12.23 ; H3#11.23 90.09,25.23 90.61,24.71 97.22,24.71 99.7,27.18 99.7,35.56 H1#11.3 ; H3#7.23 170.48,75.14 171,74.62 177.61,74.62 180.09,77.09 180.09,85.47 H1#7.3 ; H3.23 10.21,75.14 10.73,74.62 17.34,74.62 19.81,77.09 19.81,85.47 H1.3 ; H1#5.3 126.36,85.6 126.36,77.22 123.89,74.74 117.28,74.74 116.76,75.26 H3#5.23 ; H3#8.23 10.21,25.1 10.73,24.58 17.34,24.58 19.81,27.05 19.81,35.43 16,39.24 ; 42.67,39.24 46.48,35.43 46.48,27.05 44.01,24.58 37.4,24.58 36.88,25.1 H3#9.23 ; H3#4.23 90.09,75.26 90.61,74.74 97.22,74.74 99.7,77.22 99.7,85.6 H1#4.3 ; H1#3.3 73.03,85.6 73.03,77.22 70.55,74.74 63.94,74.74 63.42,75.26 H3#3.23 ; H1#6.3 153.16,85.6 153.16,77.22 150.69,74.74 144.08,74.74 143.56,75.26 H3#6.23
CD2: length 237.9
  Top Layer w0.52: H1#10.7 70.75,32.75 70.75,30.37 69.09,28.7 65.02,28.7 62.5,31.23 H3#10.29 ; H1#6.7 150.89,82.79 150.89,80.41 149.23,78.74 145.16,78.74 142.64,81.26 H3#6.29 ; H3#5.29 115.84,81.26 118.36,78.74 122.43,78.74 124.09,80.41 124.09,82.79 H1#5.7 ; H1.7 17.54,82.66 17.54,80.28 15.88,78.61 11.81,78.61 9.29,81.14 H3.29 ; H3#7.29 169.56,81.14 172.08,78.61 176.15,78.61 177.81,80.28 177.81,82.66 H1#7.7 ; H1#14.7 177.81,32.62 177.81,30.24 176.15,28.58 172.08,28.58 169.56,31.1 H3#14.29 ; H1#11.7 97.42,32.75 97.42,30.37 95.76,28.7 91.69,28.7 89.17,31.23 H3#11.29 ; H1#12.7 124.09,32.75 124.09,30.37 122.43,28.7 118.36,28.7 115.84,31.23 H3#12.29 ; H3#9.29 35.96,31.1 38.48,28.58 42.55,28.58 44.21,30.24 44.21,32.62 H1#9.7 ; H1#13.7 150.89,32.75 150.89,30.37 149.23,28.7 145.16,28.7 142.64,31.23 H3#13.29 ; H1#4.7 97.42,82.79 97.42,80.41 95.76,78.74 91.69,78.74 89.17,81.26 H3#4.29 ; H1#2.7 44.21,82.66 44.21,80.28 42.55,78.61 38.48,78.61 35.96,81.14 H3#2.29 ; H1#8.7 17.54,32.62 17.54,30.24 15.88,28.58 11.81,28.58 9.29,31.1 H3#8.29 ; H3#3.29 62.5,81.26 65.02,78.74 69.09,78.74 70.75,80.41 70.75,82.79 H1#3.7
IO32: length 456.2
  Bottom Layer w0.87: 170.81,152.78 177.93,152.78 188.72,141.99 188.72,136.53 190.63,134.62 190.63,129.41 189.74,128.52 188.72,128.52 ; H4#4.7 156.34,218.44 157.23,219.33 157.23,224.54 155.32,226.44 155.32,231.9 144.53,242.7 137.41,242.7 ; 70.99,242.7 78.11,242.7 88.9,231.9 88.9,226.44 90.8,224.54 90.8,219.33 89.92,218.44 H4#2.7 ; 122.17,218.57 123.19,218.57 124.08,219.46 124.08,224.66 122.17,226.57 122.17,232.03 111.38,242.82 H9#3.1 ; H4#8.7 56.77,128.27 57.66,129.16 57.66,134.37 55.75,136.27 55.75,141.73 44.96,152.53 H9#7.1 ; 88.9,128.4 89.92,128.4 90.8,129.29 90.8,134.49 88.9,136.4 88.9,141.86 78.11,152.65 H9#6.1 ; H9.1 44.96,242.57 55.75,231.78 55.75,226.31 57.66,224.41 57.66,219.2 56.77,218.31 H4.7 ; H9#11.1 11.94,152.53 22.73,141.73 22.73,136.27 24.64,134.37 24.64,129.16 23.75,128.27 H4#7.7 ; H9#12.1 11.94,242.57 22.73,231.78 22.73,226.31 24.64,224.41 24.64,219.2 23.75,218.31 H4#12.7 ; 104.27,152.78 111.38,152.78 122.17,141.99 122.17,136.53 124.08,134.62 124.08,129.41 123.19,128.52 122.17,128.52 ; 155.32,128.4 156.34,128.4 157.23,129.29 157.23,134.49 155.32,136.4 155.32,141.86 144.53,152.65 H9#9.1 ; H9#5.1 177.93,242.82 188.72,232.03 188.72,226.57 190.63,224.66 190.63,219.46 189.74,218.57 188.72,218.57
IO33: length 528.9
  Top Layer w0.52: H3#12.31 115.49,33.23 118.87,29.84 120.65,29.84 H1#12.9 ; H3#10.31 62.15,33.23 65.53,29.84 67.31,29.84 H1#10.9 ; H1#13.9 147.45,29.84 145.67,29.84 142.29,33.23 H3#13.31 ; H3#9.31 35.61,33.1 38.99,29.72 40.77,29.72 42.67,31.62 ; H3#5.31 115.49,83.26 118.87,79.88 120.65,79.88 H1#5.9 ; H1#4.9 93.98,79.88 92.2,79.88 88.82,83.26 H3#4.31 ; 16,31.62 14.1,29.72 12.32,29.72 8.94,33.1 H3#8.31 ; H3#11.31 88.82,33.23 92.2,29.84 93.98,29.84 H1#11.9 ; H1.9 14.1,79.76 12.32,79.76 8.94,83.14 H3.31 ; H1#7.9 174.37,79.76 172.59,79.76 169.21,83.14 H3#7.31 ; H3#14.31 169.21,33.1 172.59,29.72 174.37,29.72 176.28,31.62 ; H1#2.9 40.77,79.76 38.99,79.76 35.61,83.14 H3#2.31 ; H1#6.9 147.45,79.88 145.67,79.88 142.29,83.26 H3#6.31 ; H3#3.31 62.15,83.26 65.53,79.88 67.31,79.88 H1#3.9
  Bottom Layer w0.87: 188.72,221.11 188.72,224.16 187.07,225.81 187.07,231.27 178.05,240.28 H9#5.2 ; H9#12.2 12.06,240.03 21.08,231.01 21.08,225.55 22.73,223.9 H4#12.9 ; H9#6.2 78.23,150.11 87.25,141.1 87.25,135.64 88.9,133.99 H4#6.9 ; 70.99,240.16 78.23,240.16 87.25,231.14 87.25,225.68 88.9,224.03 H4#2.9 ; H9#8.2 111.51,150.24 120.52,141.22 120.52,135.76 122.17,134.11 122.17,131.06 ; H9#7.2 45.08,149.99 54.1,140.97 54.1,135.51 55.75,133.86 H4#8.9 ; H4#10.9 155.32,133.99 153.67,135.64 153.67,141.1 144.65,150.11 H9#9.2 ; 122.17,221.11 122.17,224.16 120.52,225.81 120.52,231.27 111.51,240.28 H9#3.2 ; H4#4.9 155.32,224.03 153.67,225.68 153.67,231.14 144.65,240.16 137.41,240.16 ; H9#10.2 178.05,150.24 187.07,141.22 187.07,135.76 188.72,134.11 188.72,131.06 ; H4#7.9 22.73,133.86 21.08,135.51 21.08,140.97 12.06,149.99 H9#11.2 ; H4.9 55.75,223.9 54.1,225.55 54.1,231.01 45.08,240.03 H9.2
RX: length 650.5
  Top Layer w0.52: 176.28,91.82 181.1,87 181.1,76.58 177.17,72.64 172.08,72.64 170.31,70.87 170.31,66.93 168.53,65.15 167.13,65.15 H3#7.13 ; H3#6.13 140.21,65.28 141.61,65.28 143.38,67.06 143.38,70.99 145.16,72.77 150.24,72.77 154.18,76.71 154.18,87.12 H1#6.1 ; H3.13 6.86,65.15 8.26,65.15 10.03,66.93 10.03,70.87 11.81,72.64 16.89,72.64 20.83,76.58 20.83,87 16,91.82 ; H3#5.13 113.41,65.28 114.81,65.28 116.59,67.06 116.59,70.99 118.36,72.77 123.44,72.77 127.38,76.71 127.38,87.12 H1#5.1 ; H3#11.13 86.74,15.24 88.14,15.24 89.92,17.02 89.92,20.96 91.69,22.73 96.77,22.73 100.71,26.67 100.71,37.08 H1#11.1 ; H3#13.13 140.21,15.24 141.61,15.24 143.38,17.02 143.38,20.96 145.16,22.73 150.24,22.73 154.18,26.67 154.18,37.08 H1#13.1 ; H3#4.13 86.74,65.28 88.14,65.28 89.92,67.06 89.92,70.99 91.69,72.77 96.77,72.77 100.71,76.71 100.71,87.12 H1#4.1 ; H1#3.1 74.04,87.12 74.04,76.71 70.1,72.77 65.02,72.77 63.25,70.99 63.25,67.06 61.47,65.28 60.07,65.28 H3#3.13 ; H3#2.13 33.53,65.15 34.92,65.15 36.7,66.93 36.7,70.87 38.48,72.64 43.56,72.64 47.5,76.58 47.5,87 42.67,91.82 ; H3#14.13 167.13,15.11 168.53,15.11 170.31,16.89 170.31,20.83 172.08,22.61 177.17,22.61 181.1,26.54 181.1,36.96 H1#14.1 ; H3#10.13 60.07,15.24 61.47,15.24 63.25,17.02 63.25,20.96 65.02,22.73 70.1,22.73 74.04,26.67 74.04,37.08 H1#10.1 ; H1#12.1 127.38,37.08 127.38,26.67 123.44,22.73 118.36,22.73 116.59,20.96 116.59,17.02 114.81,15.24 113.41,15.24 H3#12.13 ; H1#8.1 20.83,36.96 20.83,26.54 16.89,22.61 11.81,22.61 10.03,20.83 10.03,16.89 8.26,15.11 6.86,15.11 H3#8.13 ; H3#9.13 33.53,15.11 34.92,15.11 36.7,16.89 36.7,20.83 38.48,22.61 43.56,22.61 47.5,26.54 47.5,36.96 H1#9.1
  Bottom Layer w0.87: H8#6.3 88.9,114.81 H4#6.1 ; H4.1 55.75,204.72 H8.3 ; 188.72,120.9 188.72,114.94 H8#11.3 ; H8#8.3 22.73,114.68 H4#7.1 ; H8#10.3 155.32,114.81 H4#10.1 ; H8#5.3 188.72,204.98 188.72,210.95 ; H8#12.3 22.73,204.72 H4#12.1 ; 122.17,210.95 122.17,204.98 H8#3.3 ; H4#8.1 55.75,114.68 H8#9.3 ; H4#2.1 88.9,204.85 H8#2.3 ; H8#4.3 155.32,204.85 H4#4.1 ; H8#7.3 122.17,114.94 122.17,120.9
SCL: length 706.1
  Top Layer w0.52: H3#6.12 136.52,64.93 136.52,91.44 138.18,93.09 143.13,93.09 H1#6.4 ; H1#11.4 89.66,43.05 84.71,43.05 83.06,41.4 83.06,14.89 H3#11.12 ; H3#3.12 56.39,64.93 56.39,91.44 58.04,93.09 62.99,93.09 H1#3.4 ; H3#9.12 29.84,14.77 29.84,41.28 31.5,42.93 36.45,42.93 40.13,39.24 ; 13.46,39.24 9.78,42.93 4.83,42.93 3.17,41.28 3.17,14.77 H3#8.12 ; H3.12 3.17,64.8 3.17,91.31 4.83,92.96 9.78,92.96 H1.4 ; 173.74,39.24 170.05,42.93 165.1,42.93 163.45,41.28 163.45,14.77 H3#14.12 ; H3#12.12 109.73,14.89 109.73,41.4 111.38,43.05 116.33,43.05 H1#12.4 ; H3#2.12 29.84,64.8 29.84,91.31 31.5,92.96 36.45,92.96 H1#2.4 ; H1#7.4 170.05,92.96 165.1,92.96 163.45,91.31 163.45,64.8 H3#7.12 ; H1#4.4 89.66,93.09 84.71,93.09 83.06,91.44 83.06,64.93 H3#4.12 ; H1#10.4 62.99,43.05 58.04,43.05 56.39,41.4 56.39,14.89 H3#10.12 ; H3#5.12 109.73,64.93 109.73,91.44 111.38,93.09 116.33,93.09 H1#5.4 ; H1#13.4 143.13,43.05 138.18,43.05 136.52,41.4 136.52,14.89 H3#13.12
  Bottom Layer w0.87: 20.19,115.06 19.81,114.68 19.43,114.68 18.42,115.7 18.42,121.41 H4#7.4 ; 86.36,115.19 85.98,114.81 85.6,114.81 84.58,115.82 84.58,121.54 H4#6.4 ; 186.18,115.32 185.8,114.94 185.42,114.94 184.4,115.95 184.4,121.67 H4#11.4 ; 152.78,205.23 152.4,204.85 152.02,204.85 151,205.87 151,211.58 H4#4.4 ; 186.18,205.36 185.8,204.98 185.42,204.98 184.4,205.99 184.4,211.71 H4#5.4 ; H4#2.4 84.58,211.58 84.58,205.87 85.6,204.85 85.98,204.85 86.36,205.23 ; H4#8.4 51.44,121.41 51.44,115.7 52.45,114.68 52.83,114.68 53.21,115.06 ; H4#12.4 18.42,211.46 18.42,205.74 19.43,204.72 19.81,204.72 20.19,205.11 ; 152.78,115.19 152.4,114.81 152.02,114.81 151,115.82 151,121.54 H4#10.4 ; H4#3.4 117.86,211.71 117.86,205.99 118.87,204.98 119.25,204.98 119.63,205.36 ; H4.4 51.44,211.46 51.44,205.74 52.45,204.72 52.83,204.72 53.21,205.11 ; 119.63,115.32 119.25,114.94 118.87,114.94 117.86,115.95 117.86,121.67 H4#9.4
SDA: length 675.8
  Top Layer w0.52: H3#6.10 137.75,61.26 135.51,63.5 135.51,92.08 137.67,94.23 144.53,94.23 H1#6.2 ; H1#14.2 171.45,44.07 164.59,44.07 162.43,41.91 162.43,13.34 164.67,11.1 H3#14.10 ; H3#3.10 57.61,61.26 55.37,63.5 55.37,92.08 57.53,94.23 64.39,94.23 H1#3.2 ; H3#9.10 31.07,11.1 28.83,13.34 28.83,41.91 30.99,44.07 37.85,44.07 H1#9.2 ; 40.13,91.82 37.85,94.11 30.99,94.11 28.83,91.95 28.83,63.37 31.07,61.14 H3#2.10 ; H1#12.2 117.73,44.2 110.87,44.2 108.71,42.04 108.71,13.46 110.95,11.23 H3#12.10 ; 13.46,91.82 11.18,94.11 4.32,94.11 2.16,91.95 2.16,63.37 4.4,61.14 H3.10 ; H3#7.10 164.67,61.14 162.43,63.37 162.43,91.95 164.59,94.11 171.45,94.11 173.74,91.82 ; H1#5.2 117.73,94.23 110.87,94.23 108.71,92.08 108.71,63.5 110.95,61.26 H3#5.10 ; H1#4.2 91.06,94.23 84.2,94.23 82.04,92.08 82.04,63.5 84.28,61.26 H3#4.10 ; H3#13.10 137.75,11.23 135.51,13.46 135.51,42.04 137.67,44.2 144.53,44.2 H1#13.2 ; H1#11.2 91.06,44.2 84.2,44.2 82.04,42.04 82.04,13.46 84.28,11.23 H3#11.10 ; H3#8.10 4.4,11.1 2.16,13.34 2.16,41.91 4.32,44.07 11.18,44.07 H1#8.2 ; H3#10.10 57.61,11.23 55.37,13.46 55.37,42.04 57.53,44.2 64.39,44.2 H1#10.2
  Bottom Layer w0.87: H8#10.1 H4#10.2 ; H8#2.1 H4#2.2 ; H8#5.1 H4#5.2 ; H8#8.1 H4#7.2 ; H8#12.1 H4#12.2 ; 119.63,117.48 H4#9.2 ; H8#6.1 H4#6.2 ; H8#4.1 H4#4.2 ; H8#9.1 H4#8.2 ; H8.1 H4.2 ; 186.18,117.48 H4#11.2 ; H8#3.1 H4#3.2
TX: length 532.4
  Top Layer w0.52: H3#10.27 62.85,29.23 64.64,27.43 69.47,27.43 71.88,29.84 71.88,34.16 H1#10.5 ; H1#6.5 152.02,84.2 152.02,79.88 149.61,77.47 144.78,77.47 142.99,79.26 H3#6.27 ; H3#13.27 142.99,29.23 144.78,27.43 149.61,27.43 152.02,29.84 152.02,34.16 H1#13.5 ; H1#5.5 125.22,84.2 125.22,79.88 122.81,77.47 117.98,77.47 116.19,79.26 H3#5.27 ; H1#14.5 178.94,34.04 178.94,29.72 176.53,27.31 171.7,27.31 169.91,29.1 H3#14.27 ; H3#2.27 36.31,79.14 38.1,77.34 42.93,77.34 45.34,79.76 45.34,84.07 H1#2.5 ; H1#12.5 125.22,34.16 125.22,29.84 122.81,27.43 117.98,27.43 116.19,29.23 H3#12.27 ; H3#8.27 9.64,29.1 11.43,27.31 16.26,27.31 18.67,29.72 18.67,34.04 H1#8.5 ; H3#3.27 62.85,79.26 64.64,77.47 69.47,77.47 71.88,79.88 71.88,84.2 H1#3.5 ; H1#7.5 178.94,84.07 178.94,79.76 176.53,77.34 171.7,77.34 169.91,79.14 H3#7.27 ; H3#11.27 89.52,29.23 91.31,27.43 96.14,27.43 98.55,29.84 98.55,34.16 H1#11.5 ; H3#9.27 36.31,29.1 38.1,27.31 42.93,27.31 45.34,29.72 45.34,34.04 H1#9.5 ; H3#4.27 89.52,79.26 91.31,77.47 96.14,77.47 98.55,79.88 98.55,84.2 H1#4.5 ; H1.5 18.67,84.07 18.67,79.76 16.26,77.34 11.43,77.34 9.64,79.14 H3.27
  Bottom Layer w0.87: H8#3.4 123.95,204.22 123.95,215.01 122.94,216.03 122.17,216.03 ; H8#6.4 90.68,114.05 90.68,124.84 89.66,125.86 H4#6.5 ; 86.36,199.77 90.68,204.09 90.68,214.88 89.66,215.9 H4#2.5 ; H4#7.5 23.5,125.73 24.51,124.71 24.51,113.92 H8#8.4 ; 186.18,109.86 190.5,114.17 190.5,124.97 189.48,125.98 188.72,125.98 ; H4#8.5 56.52,125.73 57.53,124.71 57.53,113.92 H8#9.4 ; 152.78,199.77 157.1,204.09 157.1,214.88 156.08,215.9 H4#4.5 ; H8#5.4 190.5,204.22 190.5,215.01 189.48,216.03 188.72,216.03 ; H8.4 57.53,203.96 57.53,214.76 56.52,215.77 H4.5 ; H8#12.4 24.51,203.96 24.51,214.76 23.5,215.77 H4#12.5 ; 119.63,109.86 123.95,114.17 123.95,124.97 122.94,125.98 122.17,125.98 ; H4#10.5 156.08,125.86 157.1,124.84 157.1,114.05 H8#10.4
$1N407: length 114.8
  Bottom Layer w1.87: U5#11.3 181.02,116.61 RLY1#11.3 ; U5#5.3 181.02,206.66 RLY1#5.3 ; U5#2.3 81.2,206.53 RLY1#2.3 ; RLY1#3.3 114.47,206.66 U5#3.3 ; RLY1#4.3 147.62,206.53 U5#4.3 ; RLY1#10.3 147.62,116.49 U5#9.3 ; RLY1.3 48.05,206.4 U5.3 ; U5#7.3 15.03,116.36 RLY1#6.3 ; U5#10.3 48.05,116.36 RLY1#7.3 ; RLY1#12.3 15.03,206.4 U5#12.3 ; U5#6.3 81.2,116.49 RLY1#8.3 ; RLY1#9.3 114.47,116.61 U5#8.3
$1N669: length 91.4
  Bottom Layer w0.87: R1#12.2 179.79,138.47 181.61,136.65 Q2#11.2 ; Q2#2.2 81.79,226.57 79.97,228.39 R1#2.2 ; R1#3.2 113.24,228.52 115.06,226.7 Q2#3.2 ; Q2#7.2 115.06,136.65 113.24,138.47 R1#10.2 ; Q2#6.2 81.79,136.53 79.97,138.35 R1#6.2 ; Q2#5.2 181.61,226.7 179.79,228.52 R1#5.2 ; R1#8.2 46.82,138.22 48.64,136.4 Q2#9.2 ; R1#11.2 146.39,138.35 148.21,136.53 Q2#10.2 ; Q2#4.2 148.21,226.57 146.39,228.39 R1#4.2 ; Q2#8.2 15.62,136.4 13.8,138.22 R1#7.2 ; R1#9.2 13.8,228.26 15.62,226.44 Q2#12.2 ; R1.2 46.82,228.26 48.64,226.44 Q2.2
$1N719: length 238.3
  Bottom Layer w1.62: U1#2.1 86.04,264.54 86.04,271.72 81.79,275.97 75.22,275.97 U4#2.2 ; U1#5.1 185.86,264.67 185.86,271.85 181.61,276.1 175.05,276.1 U4#5.2 ; U4#6.2 9.06,275.84 15.62,275.84 19.87,271.59 19.87,264.41 U1#12.1 ; U4#10.2 42.08,185.8 48.64,185.8 52.89,181.55 52.89,174.37 U1#8.1 ; U4#8.2 108.5,186.06 115.06,186.06 119.31,181.81 119.31,174.62 U1#9.1 ; U1#6.1 86.04,174.5 86.04,181.68 81.79,185.93 75.22,185.93 U4#7.2 ; U4#9.2 9.06,185.8 15.62,185.8 19.87,181.55 19.87,174.37 U1#7.1 ; U4#12.2 175.05,186.06 181.61,186.06 185.86,181.81 185.86,174.62 U1#11.1 ; U1#3.1 119.31,264.67 119.31,271.85 115.06,276.1 108.5,276.1 U4#3.2 ; U4.2 42.08,275.84 48.64,275.84 52.89,271.59 52.89,264.41 U1.1 ; U1#4.1 152.46,264.54 152.46,271.72 148.21,275.97 141.64,275.97 U4#4.2 ; U4#11.2 141.64,185.93 148.21,185.93 152.46,181.68 152.46,174.5 U1#10.1
$1N726: length 131
  Bottom Layer w1.62: U1#6.2 81.04,174.5 81.04,178.55 78.74,180.85 75.22,180.85 U4#7.1 ; U4#3.1 108.5,271.02 112.01,271.02 114.31,268.72 114.31,264.67 U1#3.2 ; U1#2.2 81.04,264.54 81.04,268.59 78.74,270.89 75.22,270.89 U4#2.1 ; U4#5.1 175.05,271.02 178.56,271.02 180.86,268.72 180.86,264.67 U1#5.2 ; U4#6.1 9.06,270.76 12.57,270.76 14.87,268.47 14.87,264.41 U1#12.2 ; U4#4.1 141.64,270.89 145.16,270.89 147.46,268.59 147.46,264.54 U1#4.2 ; U1.2 47.89,264.41 47.89,268.47 45.59,270.76 42.08,270.76 U4.1 ; U1#8.2 47.89,174.37 47.89,178.42 45.59,180.72 42.08,180.72 U4#10.1 ; U1#7.2 14.87,174.37 14.87,178.42 12.57,180.72 9.06,180.72 U4#9.1 ; U1#10.2 147.46,174.5 147.46,178.55 145.16,180.85 141.64,180.85 U4#11.1 ; U1#9.2 114.31,174.62 114.31,178.68 112.01,180.98 108.5,180.98 U4#8.1 ; U1#11.2 180.86,174.62 180.86,178.68 178.56,180.98 175.05,180.98 U4#12.1
$1N778: length 280.3
  Bottom Layer w1.87: RLY1#7.5 U5#10.2 ; RLY1#11.5 U5#11.2 ; 10.03,221.6 U5#12.2 ; RLY1#9.5 U5#8.2 ; RLY1#4.5 U5#4.2 ; RLY1#8.5 U5#6.2 ; RLY1#6.5 U5#7.2 ; RLY1#2.5 U5#2.2 ; 176.02,221.86 U5#5.2 ; 109.47,221.86 U5#3.2 ; 43.05,221.6 U5.2 ; RLY1#10.5 U5#9.2
$1N787: length 114.8
  Bottom Layer w1.87: U5#3.1 104.47,206.66 RLY1#3.2 ; RLY1#9.2 104.47,116.61 U5#8.1 ; U5#10.1 38.05,116.36 RLY1#7.2 ; U5#11.1 171.02,116.61 RLY1#11.2 ; U5#12.1 5.03,206.4 RLY1#12.2 ; RLY1#2.2 71.2,206.53 U5#2.1 ; RLY1#8.2 71.2,116.49 U5#6.1 ; RLY1#5.2 171.02,206.66 U5#5.1 ; RLY1.2 38.05,206.4 U5.1 ; U5#4.1 137.62,206.53 RLY1#4.2 ; RLY1#10.2 137.62,116.49 U5#9.1 ; U5#7.1 5.03,116.36 RLY1#6.2
$1N2276: length 131.2
  Bottom Layer w0.87: D1#12.2 Q2#12.1 18.03,221.6 16.03,219.6 ; RLY1#6.4 18.03,131.56 Q2#8.1 D1#7.2 ; RLY1#4.4 150.62,221.73 Q2#4.1 D1#4.2 ; RLY1#8.4 84.2,131.69 Q2#6.1 D1#6.2 ; D1#10.2 Q2#10.1 150.62,131.69 RLY1#10.4 ; RLY1#11.4 184.02,131.81 Q2#11.1 D1#11.2 ; RLY1#7.4 51.05,131.56 Q2#9.1 D1#8.2 ; RLY1#2.4 84.2,221.73 Q2#2.1 D1#2.2 ; D1#9.2 Q2#7.1 117.48,131.81 RLY1#9.4 ; D1.2 Q2.1 51.05,221.6 49.05,219.6 ; 182.02,219.86 184.02,221.86 Q2#5.1 D1#5.2 ; 115.47,219.86 117.48,221.86 Q2#3.1 D1#3.2

## Copper pours and planes (outline as drawn; the poured copper is in the pictures)
GND on Top Layer: 106.55,50.17 106.55,96.77 129.41,96.77 129.41,50.17
GND on Top Layer: 106.55,0.13 106.55,46.74 129.41,46.74 129.41,0.13
GND on Top Layer: 0,50.04 0,96.65 22.86,96.65 22.86,50.04
GND on Top Layer: 79.88,50.17 79.88,96.77 102.74,96.77 102.74,50.17
GND on Top Layer: 26.67,50.04 26.67,96.65 49.53,96.65 49.53,50.04
GND on Top Layer: 160.27,50.04 160.27,96.65 183.13,96.65 183.13,50.04
GND on Top Layer: 26.67,0 26.67,46.61 49.53,46.61 49.53,0
GND on Top Layer: 160.27,0 160.27,46.61 183.13,46.61 183.13,0
GND on Top Layer: 0,0 0,46.61 22.86,46.61 22.86,0
GND on Top Layer: 133.35,50.17 133.35,96.77 156.21,96.77 156.21,50.17
GND on Top Layer: 79.88,0.13 79.88,46.74 102.74,46.74 102.74,0.13
GND on Top Layer: 53.21,50.17 53.21,96.77 76.07,96.77 76.07,50.17
GND on Top Layer: 133.35,0.13 133.35,46.74 156.21,46.74 156.21,0.13
GND on Top Layer: 53.21,0.13 53.21,46.74 76.07,46.74 76.07,0.13
GND on Bottom Layer: 95.76,171.58 95.76,102.2 66.09,102.2 66.09,171.58
GND on Bottom Layer: 62.61,171.45 62.61,102.08 32.94,102.08 32.94,171.45
GND on Bottom Layer: 62.61,261.49 62.61,192.12 32.94,192.12 32.94,261.49
GND on Bottom Layer: 162.18,171.58 162.18,102.2 132.51,102.2 132.51,171.58
GND on Bottom Layer: 195.58,261.75 195.58,192.37 165.91,192.37 165.91,261.75
GND on Bottom Layer: 29.59,261.49 29.59,192.12 -0.08,192.12 -0.08,261.49
GND on Bottom Layer: 162.18,261.62 162.18,192.25 132.51,192.25 132.51,261.62
GND on Bottom Layer: 129.03,261.75 129.03,192.37 99.36,192.37 99.36,261.75
GND on Bottom Layer: 29.59,171.45 29.59,102.08 -0.08,102.08 -0.08,171.45
GND on Bottom Layer: 129.03,171.7 129.03,102.33 99.36,102.33 99.36,171.7
GND on Bottom Layer: 195.58,171.7 195.58,102.33 165.91,102.33 165.91,171.7
GND on Bottom Layer: 95.76,261.62 95.76,192.25 66.09,192.25 66.09,261.62
